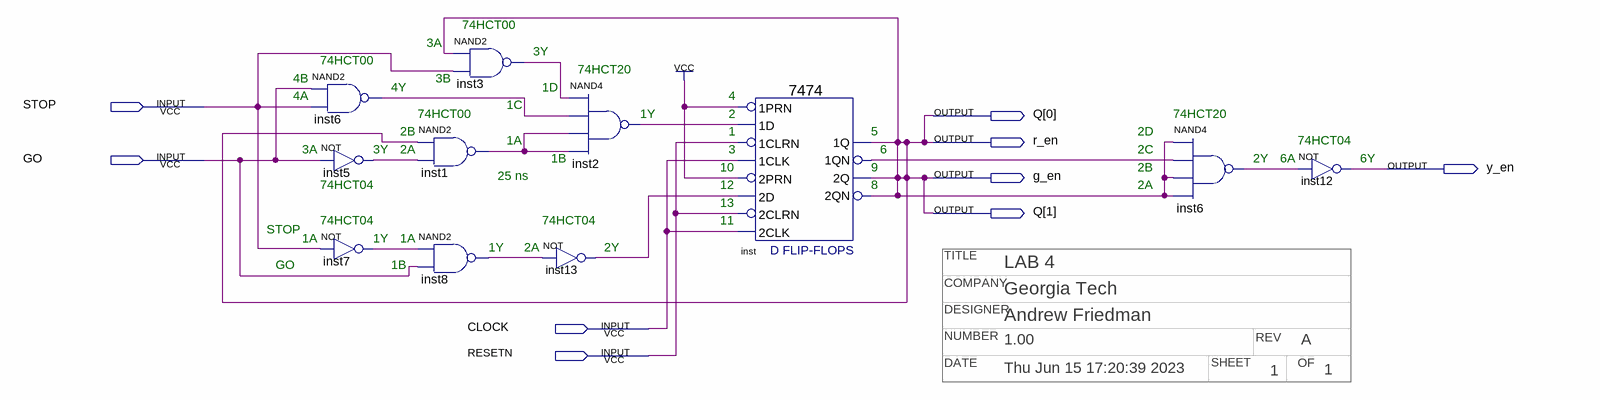
[diagram p0: schematic sheet]
// Quartus schematic Lab2.bdf as structural Verilog: 11 symbols, 9 pins
// Title block: COMPANY: Georgia Tech; DATE: Thu Jun 15 17:20:39 2023; DESIGNER: Andrew Friedman; NUMBER: 1.00; OF: 1; REV: A; SHEET: 1; TITLE: LAB 4
module Lab2 (
  input  STOP,
  input  GO,
  input  CLOCK,
  input  RESETN,
  output [1:0] Q,
  output r_en,
  output y_en,
  output g_en
);

  wire inst1_out, inst2_out, inst3_out, inst5_out, inst6_out, inst6_out_2, inst7_out, inst8_out, inst13_out,
       inst_1qn;

  nand inst6 (inst6_out, GO, STOP);
  not inst5 (inst5_out, GO);
  not inst7 (inst7_out, STOP);
  nand inst3 (inst3_out, g_en, STOP);
  nand inst1 (inst1_out, g_en, inst5_out);
  nand inst8 (inst8_out, inst7_out, GO);
  nand inst2 (inst2_out, inst3_out, inst6_out, inst1_out, inst1_out);
  not inst13 (inst13_out, inst8_out);
  \7474  inst (
    .\2D (inst13_out), .\2PRN (1'b1), .\1CLK (CLOCK), .\1D (inst2_out), .\1PRN (1'b1), .\2CLK (CLOCK),
    .\2CLRN (RESETN), .\1CLRN (RESETN), .\1QN (inst_1qn), .\2Q (g_en), .\2QN (g_en), .\1Q (g_en));
  nand inst6_dup2 (inst6_out_2, g_en, inst_1qn, g_en, g_en);
  not inst12 (y_en, inst6_out_2);

  assign Q = {2{g_en}};
  assign r_en = g_en;

  // Notes on the sheet:
  //   74HCT00
  //   3A
  //   3Y
  //   74HCT00
  //   74HCT20
  //   4B
  //   3B
  //   4Y
  //   1D
  //   4A
  //   4
  //   1C
  //   74HCT00
  //   1Y
  //   2
  //   74HCT20
  //   2B
  //   1
  //   5
  //   2D
  //   1A
  //   74HCT04
  //   3A
  //   3Y
  //   2A
  //   3
  //   6
  //   2C
  //   1B
  //   2Y
  //   6A
  //   6Y
  //   10
  //   9
  //   2B
  //   25 ns
  //   74HCT04
  //   12
  //   8
  //   2A
  //   13
  //   74HCT04
  //   74HCT04
  //   11
  //   STOP
  //   1A
  //   1Y
  //   1A
  //   1Y
  //   2A
  //   2Y
  //   GO
  //   1B
endmodule
